# EAGLE design Arduino-Pro-Mini-v10 (EAGLE 6.4)
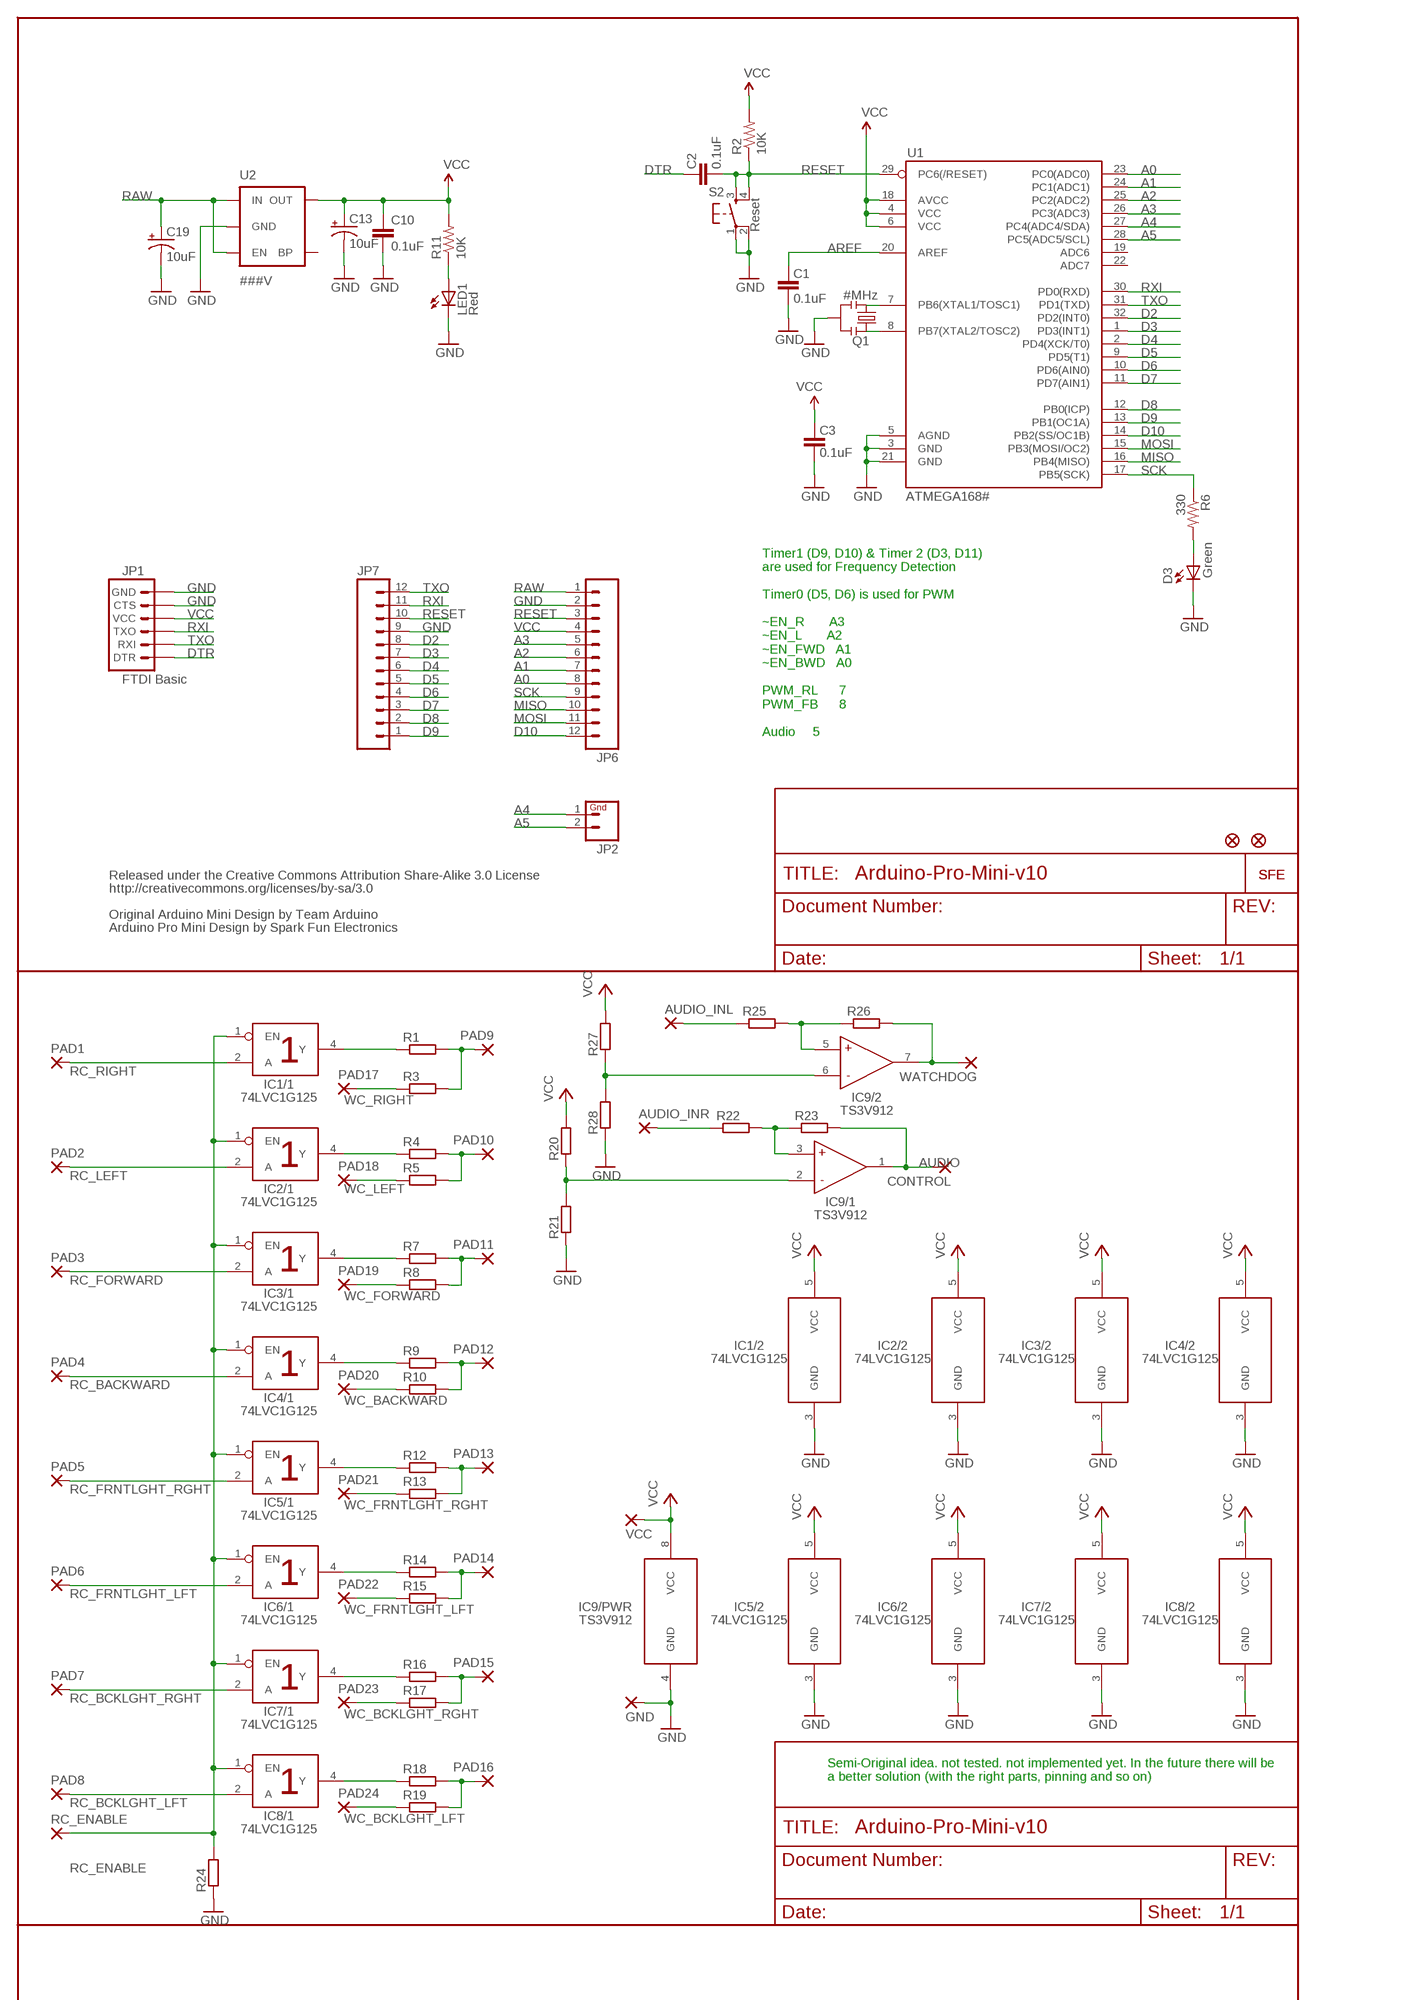
[diagram p0: schematic, sheet 1, part 1 of 2]
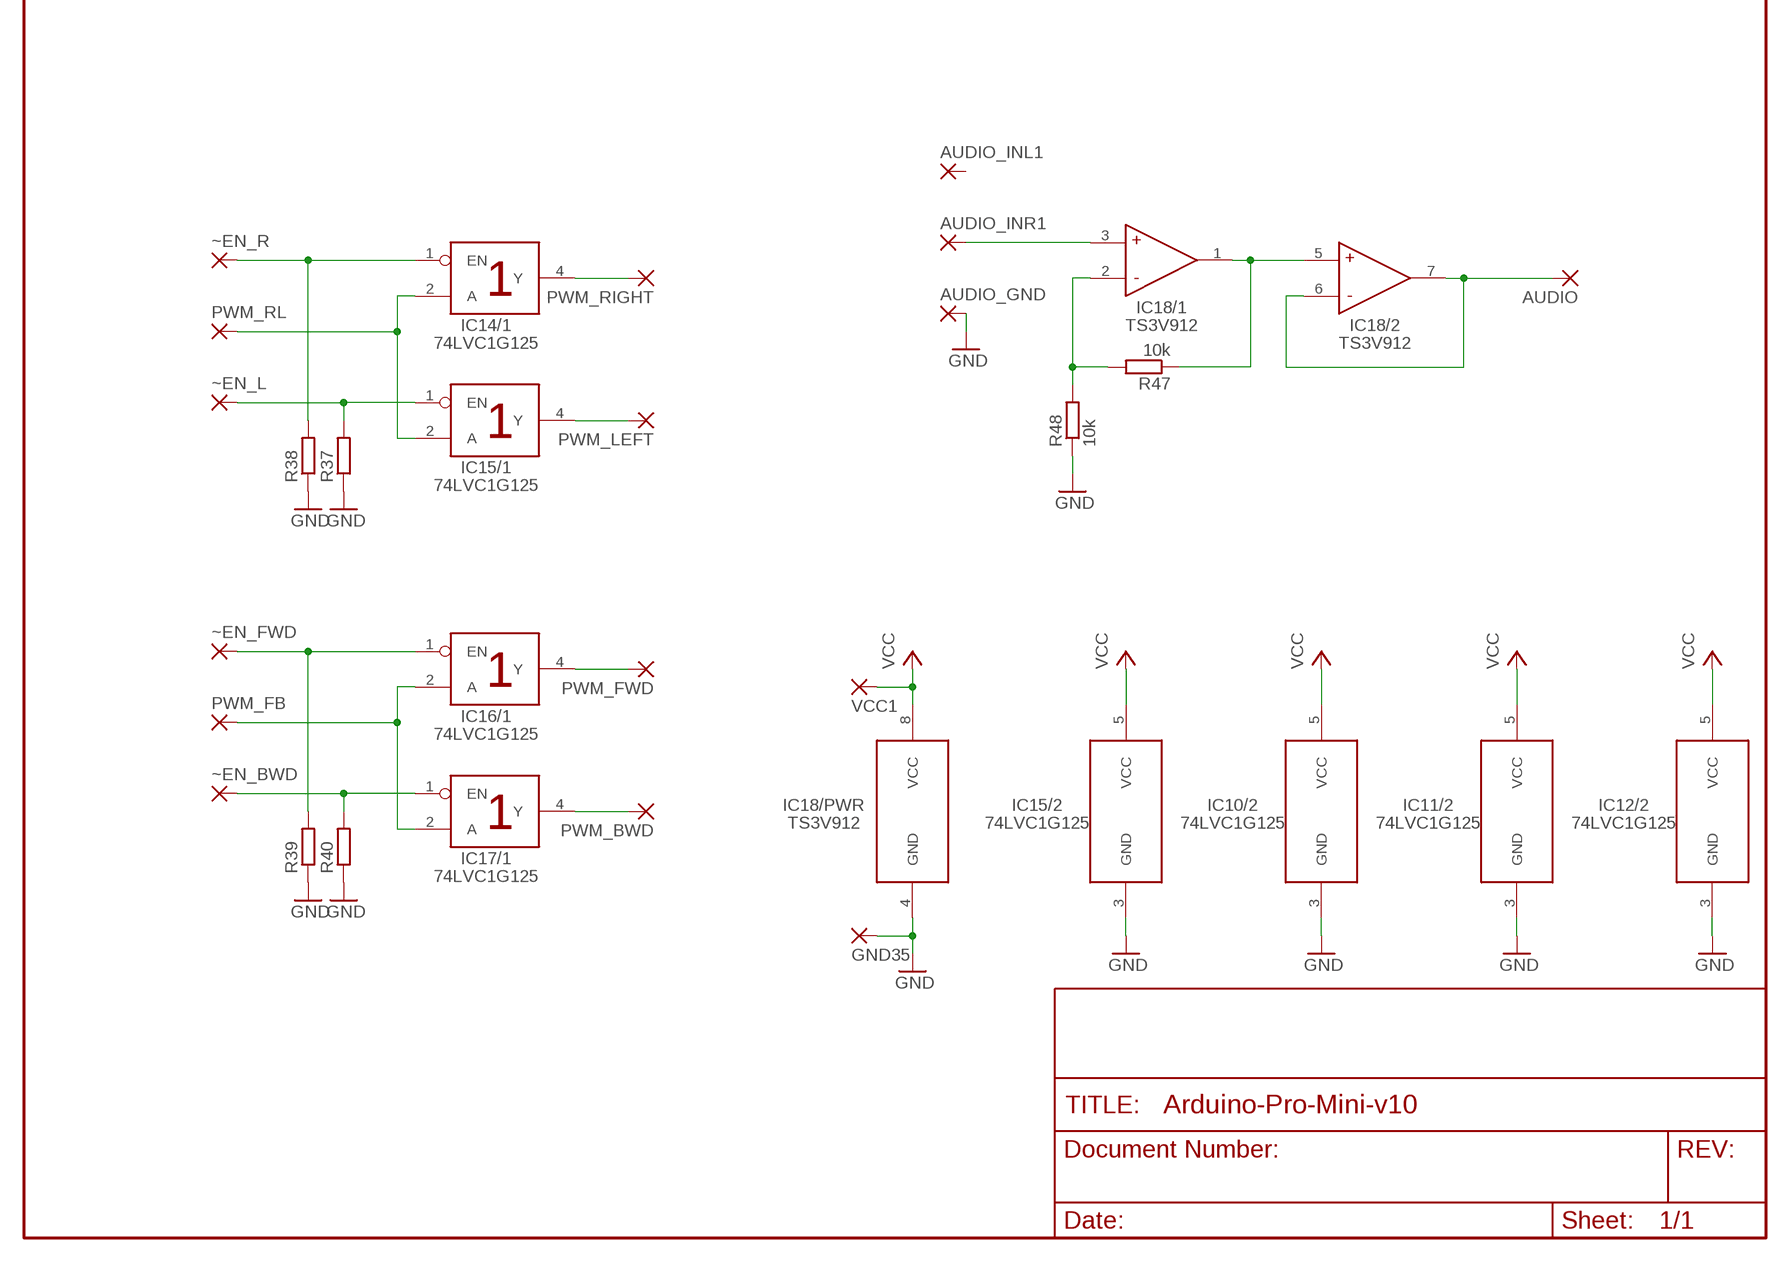
[diagram p1: schematic, sheet 1, part 2 of 2]

## Parts
AUDIO  SMD2  [SMD1,27-2,54]
AUDIO_GND  SMD2  [SMD1,27-2,54]
AUDIO_INL  SMD2  [SMD1,27-2,54]
AUDIO_INL1  SMD2  [SMD1,27-2,54]
AUDIO_INR  SMD2  [SMD1,27-2,54]
AUDIO_INR1  SMD2  [SMD1,27-2,54]
C1  0.1uF  CAP0402  [C0402]
C2  0.1uF  CAP0402  [C0402]
C3  0.1uF  CAP0402  [C0402]
C10  0.1uF  CAP0402  [C0402]
C13  10uF  CAP_POL1206  [EIA3216]
C19  10uF  CAP_POL1206  [EIA3216]
CONTROL  SMD2  [SMD1,27-2,54]
D3  Green  LED0603  [LED-0603]
GND  SMD2  [SMD1,27-2,54]
GND35  SMD2  [SMD1,27-2,54]
IC1  74LVC1G125  [DBV_R-PDSO-G5]
IC2  74LVC1G125  [DBV_R-PDSO-G5]
IC3  74LVC1G125  [DBV_R-PDSO-G5]
IC4  74LVC1G125  [DBV_R-PDSO-G5]
IC5  74LVC1G125  [DBV_R-PDSO-G5]
IC6  74LVC1G125  [DBV_R-PDSO-G5]
IC7  74LVC1G125  [DBV_R-PDSO-G5]
IC8  74LVC1G125  [DBV_R-PDSO-G5]
IC9  TS3V912  [SO8]
IC10  74LVC1G125  [DBV_R-PDSO-G5]
IC11  74LVC1G125  [DBV_R-PDSO-G5]
IC12  74LVC1G125  [DBV_R-PDSO-G5]
IC14  74LVC1G125  [DBV_R-PDSO-G5]
IC15  74LVC1G125  [DBV_R-PDSO-G5]
IC16  74LVC1G125  [DBV_R-PDSO-G5]
IC17  74LVC1G125  [DBV_R-PDSO-G5]
IC18  TS3V912  [SO8]
JP1  FTDI Basic  ARDUINO_SERIAL_PROGRAMPTH  [1X06]
JP2  M02PTH  [1X02]
JP6  M12PTH  [1X12]
JP7  M12PTH  [1X12]
LED1  Red  LED0603  [LED-0603]
PAD1  SMD2  [SMD1,27-2,54]
PAD2  SMD2  [SMD1,27-2,54]
PAD3  SMD2  [SMD1,27-2,54]
PAD4  SMD2  [SMD1,27-2,54]
PAD5  SMD2  [SMD1,27-2,54]
PAD6  SMD2  [SMD1,27-2,54]
PAD7  SMD2  [SMD1,27-2,54]
PAD8  SMD2  [SMD1,27-2,54]
PAD9  SMD2  [SMD1,27-2,54]
PAD10  SMD2  [SMD1,27-2,54]
PAD11  SMD2  [SMD1,27-2,54]
PAD12  SMD2  [SMD1,27-2,54]
PAD13  SMD2  [SMD1,27-2,54]
PAD14  SMD2  [SMD1,27-2,54]
PAD15  SMD2  [SMD1,27-2,54]
PAD16  SMD2  [SMD1,27-2,54]
PAD17  SMD2  [SMD1,27-2,54]
PAD18  SMD2  [SMD1,27-2,54]
PAD19  SMD2  [SMD1,27-2,54]
PAD20  SMD2  [SMD1,27-2,54]
PAD21  SMD2  [SMD1,27-2,54]
PAD22  SMD2  [SMD1,27-2,54]
PAD23  SMD2  [SMD1,27-2,54]
PAD24  SMD2  [SMD1,27-2,54]
PWM_BWD  SMD2  [SMD1,27-2,54]
PWM_FB  SMD2  [SMD1,27-2,54]
PWM_FWD  SMD2  [SMD1,27-2,54]
PWM_LEFT  SMD2  [SMD1,27-2,54]
PWM_RIGHT  SMD2  [SMD1,27-2,54]
PWM_RL  SMD2  [SMD1,27-2,54]
Q1  #MHz  RESONATORSMD  [RESONATOR-SMD]
R1  R-EU_M0805  [M0805]
R2  10K  RESISTOR0402  [C0402]
R3  R-EU_M0805  [M0805]
R4  R-EU_M0805  [M0805]
R5  R-EU_M0805  [M0805]
R6  330  RESISTOR0402  [C0402]
R7  R-EU_M0805  [M0805]
R8  R-EU_M0805  [M0805]
R9  R-EU_M0805  [M0805]
R10  R-EU_M0805  [M0805]
R11  10K  RESISTOR0402  [C0402]
R12  R-EU_M0805  [M0805]
R13  R-EU_M0805  [M0805]
R14  R-EU_M0805  [M0805]
R15  R-EU_M0805  [M0805]
R16  R-EU_M0805  [M0805]
R17  R-EU_M0805  [M0805]
R18  R-EU_M0805  [M0805]
R19  R-EU_M0805  [M0805]
R20  R-EU_M0805  [M0805]
R21  R-EU_M0805  [M0805]
R22  R-EU_M0805  [M0805]
R23  R-EU_M0805  [M0805]
R24  R-EU_M0805  [M0805]
R25  R-EU_M0805  [M0805]
R26  R-EU_M0805  [M0805]
R27  R-EU_M0805  [M0805]
R28  R-EU_M0805  [M0805]
R37  R-EU_M0805  [M0805]
R38  R-EU_M0805  [M0805]
R39  R-EU_M0805  [M0805]
R40  R-EU_M0805  [M0805]
R47  10k  R-EU_M0805  [M0805]
R48  10k  R-EU_M0805  [M0805]
RC_ENABLE  SMD2  [SMD1,27-2,54]
S2  Reset  TAC_SWITCHSND  [TACTILE_SWITCH_SMD]
U1  ATMEGA168#  ATMEGA168  [TQFP32-08]
U2  ###V  V_REG_LDOSMD  [SOT23-5]
U$1  LOGO-SFESK  [SFE-LOGO-FLAME]
U$2  FIDUCIAL1X2  [FIDUCIAL-1X2]
U$4  FIDUCIAL1X2  [FIDUCIAL-1X2]
U$11  LOGO-SFENEW  [SFE-NEW-WEBLOGO]
VCC  SMD2  [SMD1,27-2,54]
VCC1  SMD2  [SMD1,27-2,54]
WATCHDOG  SMD2  [SMD1,27-2,54]
~EN_BWD  SMD2  [SMD1,27-2,54]
~EN_FWD  SMD2  [SMD1,27-2,54]
~EN_L  SMD2  [SMD1,27-2,54]
~EN_R  SMD2  [SMD1,27-2,54]

## Nets
A0: JP6.8 U1.23(PC0(ADC0))
A1: JP6.7 U1.24(PC1(ADC1))
A2: JP6.6 U1.25(PC2(ADC2))
A3: JP6.5 U1.26(PC3(ADC3))
A4: JP2.1 U1.27(PC4(ADC4/SDA))
A5: JP2.2 U1.28(PC5(ADC5/SCL))
AREF: C1.2 U1.20(AREF)
AUDIO: AUDIO.1(P) CONTROL.1(P) IC9.1(/1:OUT) IC18.6(/2:-) IC18.7(/2:OUT) R23.2
D2: JP7.8 U1.32(PD2(INT0))
D3: JP7.7 U1.1(PD3(INT1))
D4: JP7.6 U1.2(PD4(XCK/T0))
D5: JP7.5 U1.9(PD5(T1))
D6: JP7.4 U1.10(PD6(AIN0))
D7: JP7.3 U1.11(PD7(AIN1))
D8: JP7.2 U1.12(PB0(ICP))
D9: JP7.1 U1.13(PB1(OC1A))
D10: JP6.12 U1.14(PB2(SS/OC1B))
DTR: C2.2 JP1.1(DTR)
GND [vcc]: AUDIO_GND.1(P) C1.1 C3.1 C10.2 C13.C(-) C19.C(-) D3.C GND35.1(P) GND.1(P) IC1.3(/2:GND) IC2.3(/2:GND) IC3.3(/2:GND) IC4.3(/2:GND) IC5.3(/2:GND) IC6.3(/2:GND) IC7.3(/2:GND) IC8.3(/2:GND) IC9.4(/PWR:GND) IC10.3(/2:GND) IC11.3(/2:GND) IC12.3(/2:GND) IC15.3(/2:GND) IC18.4(/PWR:GND) JP1.5(CTS) JP1.6(GND) JP6.2 JP7.9 LED1.C Q1.2 R21.1 R24.1 R28.1 R37.1 R38.1 R39.1 R40.1 R48.1 S2.1 S2.2 U1.3(GND) U1.5(AGND) U1.21(GND) U2.2(GND)
MISO: JP6.10 U1.16(PB4(MISO))
MOSI: JP6.11 U1.15(PB3(MOSI/OC2))
N$1: Q1.1 U1.8(PB7(XTAL2/TOSC2))
N$2: Q1.3 U1.7(PB6(XTAL1/TOSC1))
N$3: IC9.2(/1:-) R20.1 R21.2
N$4: PAD9.1(P) R1.2 R3.2
N$5: PAD10.1(P) R4.2 R5.2
N$6: IC1.4(/1:Y) R1.1
N$7: D3.A R6.2
N$8: IC2.4(/1:Y) R4.1
N$9: IC3.4(/1:Y) R7.1
N$10: IC4.4(/1:Y) R9.1
N$11: IC5.4(/1:Y) R12.1
N$12: IC6.4(/1:Y) R14.1
N$13: IC7.4(/1:Y) R16.1
N$14: IC8.4(/1:Y) R18.1
N$15: PAD11.1(P) R7.2 R8.2
N$16: PAD12.1(P) R9.2 R10.2
N$17: PAD13.1(P) R12.2 R13.2
N$18: PAD14.1(P) R14.2 R15.2
N$19: PAD15.1(P) R16.2 R17.2
N$20: PAD16.1(P) R18.2 R19.2
N$21: IC9.5(/2:+) R25.2 R26.1
N$22: IC9.7(/2:OUT) R26.2 WATCHDOG.1(P)
N$23: IC9.6(/2:-) R27.1 R28.2
N$24: AUDIO_INL.1(P) R25.1
N$25: IC14.2(/1:A) IC15.2(/1:A) PWM_RL.1(P)
N$26: IC16.2(/1:A) IC17.2(/1:A) PWM_FB.1(P)
N$27: IC15.1(/1:EN) R37.2 ~EN_L.1(P)
N$28: IC14.1(/1:EN) R38.2 ~EN_R.1(P)
N$29: IC17.1(/1:EN) R40.2 ~EN_BWD.1(P)
N$30: IC16.1(/1:EN) R39.2 ~EN_FWD.1(P)
N$31: IC16.4(/1:Y) PWM_FWD.1(P)
N$32: IC9.3(/1:+) R22.2 R23.1
N$33: AUDIO_INR.1(P) R22.1
N$34: IC17.4(/1:Y) PWM_BWD.1(P)
N$35: IC14.4(/1:Y) PWM_RIGHT.1(P)
N$36: IC15.4(/1:Y) PWM_LEFT.1(P)
N$38: LED1.A R11.1
N$44: IC18.1(/1:OUT) IC18.5(/2:+) R47.1
N$45: IC18.2(/1:-) R47.2 R48.2
N$47: AUDIO_INR1.1(P) IC18.3(/1:+)
RAW [vcc]: C19.A(+) JP6.1 U2.1(IN) U2.3(EN)
RC_BACKWARD: IC4.2(/1:A) PAD4.1(P)
RC_BCKLGHT_LFT: IC8.2(/1:A) PAD8.1(P)
RC_BCKLGHT_RGHT: IC7.2(/1:A) PAD7.1(P)
RC_ENABLE: IC1.1(/1:EN) IC2.1(/1:EN) IC3.1(/1:EN) IC4.1(/1:EN) IC5.1(/1:EN) IC6.1(/1:EN) IC7.1(/1:EN) IC8.1(/1:EN) R24.2 RC_ENABLE.1(P)
RC_FORWARD: IC3.2(/1:A) PAD3.1(P)
RC_FRNTLGHT_LFT: IC6.2(/1:A) PAD6.1(P)
RC_FRNTLGHT_RGHT: IC5.2(/1:A) PAD5.1(P)
RC_LEFT: IC2.2(/1:A) PAD2.1(P)
RC_RIGHT: IC1.2(/1:A) PAD1.1(P)
RESET: C2.1 JP6.3 JP7.10 R2.1 S2.3 S2.4 U1.29(PC6(/RESET))
RXI: JP1.3(TXO) JP7.11 U1.30(PD0(RXD))
SCK: JP6.9 R6.1 U1.17(PB5(SCK))
TXO: JP1.2(RXI) JP7.12 U1.31(PD1(TXD))
VCC: C3.2 C10.1 C13.A(+) IC1.5(/2:VCC) IC2.5(/2:VCC) IC3.5(/2:VCC) IC4.5(/2:VCC) IC5.5(/2:VCC) IC6.5(/2:VCC) IC7.5(/2:VCC) IC8.5(/2:VCC) IC9.8(/PWR:VCC) IC10.5(/2:VCC) IC11.5(/2:VCC) IC12.5(/2:VCC) IC15.5(/2:VCC) IC18.8(/PWR:VCC) JP1.4(VCC) JP6.4 R2.2 R11.2 R20.2 R27.2 U1.4(VCC) U1.6(VCC) U1.18(AVCC) U2.5(OUT) VCC1.1(P) VCC.1(P)
WC_BACKWARD: PAD20.1(P) R10.1
WC_BCKLGHT_LFT: PAD24.1(P) R19.1
WC_BCKLGHT_RGHT: PAD23.1(P) R17.1
WC_FORWARD: PAD19.1(P) R8.1
WC_FRNTLGHT_LFT: PAD22.1(P) R15.1
WC_FRNTLGHT_RGHT: PAD21.1(P) R13.1
WC_LEFT: PAD18.1(P) R5.1
WC_RIGHT: PAD17.1(P) R3.1
Unconnected: AUDIO_INL1.1(P) IC10.1(/1:EN) IC10.2(/1:A) IC10.4(/1:Y) IC11.1(/1:EN) IC11.2(/1:A) IC11.4(/1:Y) IC12.1(/1:EN) IC12.2(/1:A) IC12.4(/1:Y) IC14.3(/2:GND) IC14.5(/2:VCC) IC16.3(/2:GND) IC16.5(/2:VCC) IC17.3(/2:GND) IC17.5(/2:VCC) U1.19(ADC6) U1.22(ADC7) U2.4(BP)

## Notes on the sheet
- Timer1 (D9, D10) & Timer 2 (D3, D11)
  are used for Frequency Detection
  
  Timer0 (D5, D6) is used for PWM
  
  ~EN_R       A3
  ~EN_L       A2
  ~EN_FWD   A1
  ~EN_BWD   A0
  
  PWM_RL      7
  PWM_FB      8
  
  Audio     5
- Released under the Creative Commons Attribution Share-Alike 3.0 License
- http://creativecommons.org/licenses/by-sa/3.0
- Original Arduino Mini Design by Team Arduino
- Arduino Pro Mini Design by Spark Fun Electronics
- Semi-Original idea. not tested. not implemented yet. In the future there will be 
  a better solution (with the right parts, pinning and so on)

## Library data of the parts
AUDIO AUDIO_GND AUDIO_INL AUDIO_INL1 AUDIO_INR AUDIO_INR1 CONTROL GND GND35 PAD1-PAD24 PWM_BWD PWM_FB PWM_FWD PWM_LEFT PWM_RIGHT PWM_RL RC_ENABLE VCC VCC1 WATCHDOG ~EN_BWD ~EN_FWD ~EN_L ~EN_R = wirepad:SMD2: SMD PAD
C1-C3 C10 = SparkFun:CAP: Capacitor Standard 0603 ceramic capacitor, and 0.1" leaded capacitor.
C13 C19 = SparkFun:CAP_POL: Capacitor Polarized These are standard SMD and PTH capacitors. Normally 10uF, 47uF, and 100uF in electrolytic and tantalum varieties. Always verify the external diameter of the through hole cap, it varies with capacity, voltage, and manufacturer. The EIA devices should be standard.
D3 LED1 = SparkFun:LED: LEDs Standard schematic elements and footprints for 5mm, 3mm, 1206, and 0603 sized LEDs. 5mm - Spark Fun Electronics SKU : COM-00529 (and others)
IC1-IC8 IC10-IC12 IC14-IC17 = WC-Car:74LVC1G125: 74LVC1G125 3-state single buffer with EN-input
IC9 IC18 = WC-Car:TS3V912: TS3V912 dual rail to rail operational amplifier
JP1 = SparkFun:ARDUINO_SERIAL_PROGRAM
JP2 = SparkFun:M02: Header 2 Standard 2-pin 0.1" header. Use with straight break away headers (SKU : PRT-00116), right angle break away headers (PRT-00553), swiss pins (PRT-00743), machine pins (PRT-00117), and female headers (PRT-00115). Molex polarized connector foot print use with SKU : PRT-08233 with associated crimp pins and housings.
JP6 JP7 = SparkFun:M12: Header 12 Standard 12-pin 0.1" header. Use with straight break away headers (SKU : PRT-00116), right angle break away headers (PRT-00553), swiss pins (PRT-00743), machine pins (PRT-00117), and female headers (PRT-00115).
Q1 = SparkFun:RESONATOR: Resonator Small SMD resonator. This is the itty bitty 10/20MHz resonators with built in caps. CSTCE10M0G55 and CSTCE20M0V53. Footprint has been reviewed closely but hasn't been tested yet.
R1 R3-R5 R7-R10 R12-R28 R37-R40 R47 R48 = resistor:R-EU_: RESISTOR, European symbol
R2 R6 R11 = SparkFun:RESISTOR: Resistor Basic schematic elements and footprints for 0603, 1206, and PTH 1/10th watt (small) resistors.
S2 = SparkFun:TAC_SWITCH: Momentary Switch Button commonly used for reset or general input. Spark Fun Electronics SKU : COM-00097
U1 = SparkFun:ATMEGA168
U2 = SparkFun:V_REG_LDO: Voltage Regulator LDO Standard 150mA LDO voltage regulator in SOT-23 layout. Micrel part MIC5205. BP (by-pass) pin is used to lower output noise with 470pF cap.
U$1 U$11 = SparkFun:LOGO-SFE: Spark Fun Electronics PCB Logo This is the standard Spark Fun Electronics PCB logo.
U$2 U$4 = SparkFun:FIDUCIAL: Fiducial Alignment Points Various fiducial points for machine vision alignment.

## Net classes
0 default: width 0.203 mm
1 vcc: width 0.254 mm

## Board
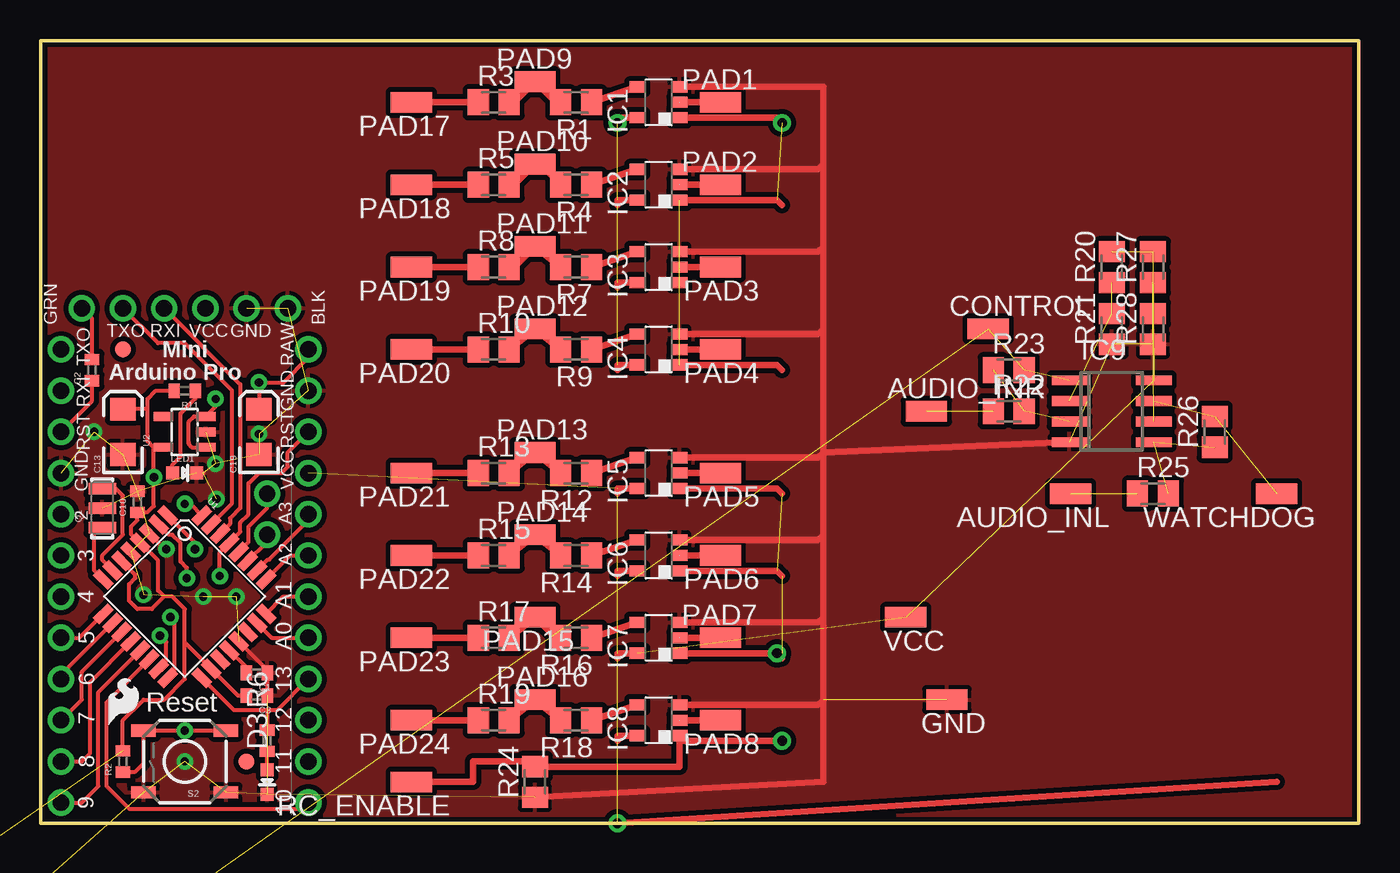
[diagram p2: board, top side]
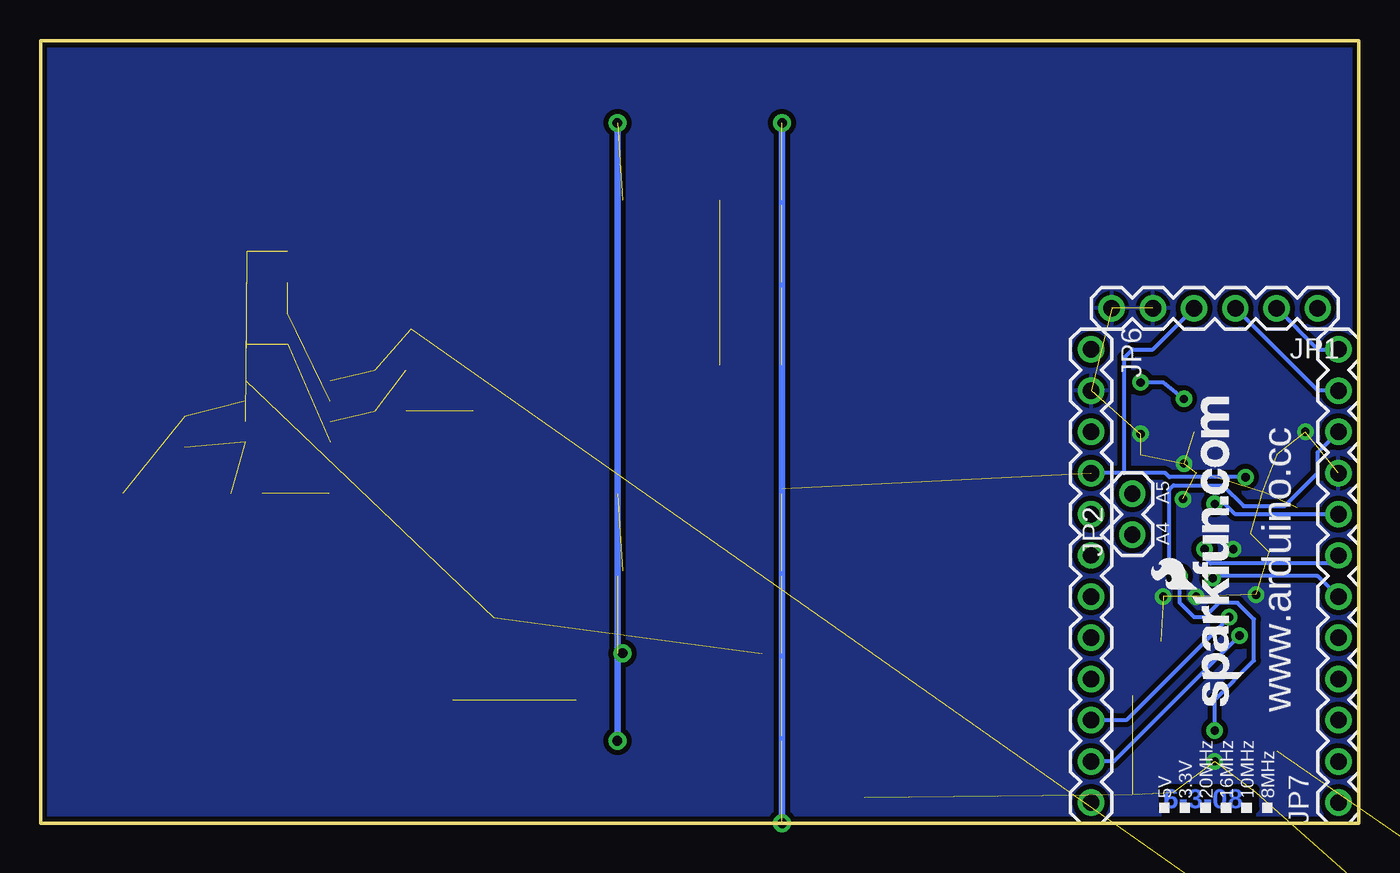
[diagram p3: board, bottom side, seen from below]

Size 81.28 x 48.26 mm. Coordinates in mm from the lower left corner, seen from the top.
Outline: 0,48.26 0,0 81.28,0 81.28,48.26 0,48.26
Copper layers (1*16): Top 0.035mm / dielectric 1.5mm / Bottom 0.035mm
Design rules "SparkFun *": minimum track width 8mil, minimum drill 20mil, track to track 8mil, track to pad 8mil, pad to pad 8mil, via to via 8mil, smd to smd 8mil, copper to edge 10mil, drill to drill 8mil, minimum pad ring 12mil, minimum via ring 10mil, stop-mask expansion 4mil, vias tented up to drill 20mil, thermal gap 10mil

### Footprints (pad centres in the part's own frame; a part is rotated, then mirrored left to right if it is on the bottom)
SMD1,27-2,54 = smd 1.27 x 2.54: 1 0,0
C0402 = smd 0.7 x 0.9: 1 -0.65,0; 2 0.65,0
EIA3216 = smd 1.4 x 1.6: A 1.4,0; C -1.4,0
LED-0603 = smd 0.8 x 0.8: A 0,-0.75; C 0,0.75
DBV_R-PDSO-G5 = smd 0.69 x 0.99: 1 -0.95,-1.29; 2 0,-1.29; 3 0.95,-1.29; 4 0.95,1.3; 5 -0.95,1.3
SO8 = smd 0.6 x 2.2: 1 -1.905,-2.6; 2 -0.635,-2.6; 3 0.635,-2.6; 4 1.905,-2.6; 5 1.905,2.6; 6 0.635,2.6; 7 -0.635,2.6; 8 -1.905,2.6
1X06 = drill 1.016: 1 0,0; 2 2.54,0; 3 5.08,0; 4 7.62,0; 5 10.16,0; 6 12.7,0
1X02 = drill 1.016: 1 0,0; 2 2.54,0
1X12 = drill 1.016: 1 0,0; 2 2.54,0; 3 5.08,0; 4 7.62,0; 5 10.16,0; 6 12.7,0; 7 15.24,0; 8 17.78,0; 9 20.32,0; 10 22.86,0; 11 25.4,0; 12 27.94,0
RESONATOR-SMD = smd 0.7 x 1.7: 1 -1.2,0; 2 0,0; 3 1.2,0
M0805 = smd 1.3 x 1.6: 1 -0.95,0; 2 0.95,0
TACTILE_SWITCH_SMD = smd 1.524 x 0.762: 1 -2.54,1.905; 2 2.54,1.905; 3 -2.54,-1.905; 4 2.54,-1.905
TQFP32-08 = smd 1.27 x 0.559: 1 -4.293,2.8; 2 -4.293,2; 3 -4.293,1.2; 4 -4.293,0.4; 5 -4.293,-0.4; 6 -4.293,-1.2; 7 -4.293,-2; 8 -4.293,-2.8; 17 4.293,-2.8; 18 4.293,-2; 19 4.293,-1.2; 20 4.293,-0.4; 21 4.293,0.4; 22 4.293,1.2; 23 4.293,2; 24 4.293,2.8 | smd 0.559 x 1.27: 9 -2.8,-4.293; 10 -2,-4.293; 11 -1.2,-4.293; 12 -0.4,-4.293; 13 0.4,-4.293; 14 1.2,-4.293; 15 2,-4.293; 16 2.8,-4.293; 25 2.8,4.293; 26 2,4.293; 27 1.2,4.293; 28 0.4,4.293; 29 -0.4,4.293; 30 -1.2,4.293; 31 -2,4.293; 32 -2.8,4.293
SOT23-5 = smd 0.55 x 1.2: 1 -0.95,-1.3; 2 0,-1.3; 3 0.95,-1.3; 4 0.95,1.3; 5 -0.95,1.3
FIDUCIAL-1X2 = smd 1 x 1: 1 0,0

### Placement (x,y rotation side)
AUDIO  -10.16,-17.78 0 top  (outside the outline)
AUDIO_GND  -45.72,-60.96 0 top  (outside the outline)
AUDIO_INL  63.5,20.32 90 top
AUDIO_INL1  -35.56,-17.78 0 top  (outside the outline)
AUDIO_INR  54.61,25.4 270 top
AUDIO_INR1  -30.48,-17.78 0 top  (outside the outline)
C1  13.34,9.27 180 top
C2  3.17,27.94 90 top
C3  13.34,7.87 180 top
C10  5.97,19.81 90 top
C13  5.08,24.13 90 top
C19  13.46,24.13 90 top
CONTROL  58.42,30.48 270 top
D3  13.97,2.54 180 top
GND  55.88,7.62 90 top
GND35  0,-35.56 0 top  (outside the outline)
IC1  38.1,44.45 90 top
IC2  38.1,39.37 90 top
IC3  38.1,34.29 90 top
IC4  38.1,29.21 90 top
IC5  38.1,21.59 90 top
IC6  38.1,16.51 90 top
IC7  38.1,11.43 90 top
IC8  38.1,6.35 90 top
IC9  66.04,25.4 270 top
IC10  -45.72,-71.12 0 top  (outside the outline)
IC11  -45.72,-78.74 0 top  (outside the outline)
IC12  -45.72,-86.36 0 top  (outside the outline)
IC14  -2.54,-27.94 0 top  (outside the outline)
IC15  -40.64,-35.56 0 top  (outside the outline)
IC16  -27.94,-35.56 0 top  (outside the outline)
IC17  -15.24,-35.56 0 top  (outside the outline)
IC18  -17.78,-15.24 0 top  (outside the outline)
JP1  2.54,31.75 180 bottom
JP2  13.97,17.78 90 bottom
JP6  16.51,29.21 270 bottom
JP7  1.27,1.27 90 bottom
LED1  8.89,21.59 270 top
PAD1  41.91,44.45 270 top
PAD2  41.91,39.37 270 top
PAD3  41.91,34.29 90 top
PAD4  41.91,29.21 90 top
PAD5  41.91,21.59 90 top
PAD6  41.91,16.51 90 top
PAD7  41.91,11.43 270 top
PAD8  41.91,6.35 90 top
PAD9  30.48,45.72 270 top
PAD10  30.48,40.64 270 top
PAD11  30.48,35.56 270 top
PAD12  30.48,30.48 270 top
PAD13  30.48,22.86 270 top
PAD14  30.48,17.78 270 top
PAD15  30.48,12.7 90 top
PAD16  30.48,7.62 270 top
PAD17  22.86,44.45 90 top
PAD18  22.86,39.37 90 top
PAD19  22.86,34.29 90 top
PAD20  22.86,29.21 90 top
PAD21  22.86,21.59 90 top
PAD22  22.86,16.51 90 top
PAD23  22.86,11.43 90 top
PAD24  22.86,6.35 90 top
PWM_BWD  15.24,-43.18 0 top  (outside the outline)
PWM_FB  -5.08,-50.8 0 top  (outside the outline)
PWM_FWD  0,-50.8 0 top  (outside the outline)
PWM_LEFT  -10.16,-50.8 0 top  (outside the outline)
PWM_RIGHT  -15.24,-50.8 0 top  (outside the outline)
PWM_RL  -25.4,-43.18 0 top  (outside the outline)
Q1  3.81,19.43 90 top
R1  33.02,44.45 180 top
R2  5.08,3.81 90 top
R3  27.94,44.45 0 top
R4  33.02,39.37 180 top
R5  27.94,39.37 0 top
R6  13.97,5.08 270 top
R7  33.02,34.29 180 top
R8  27.94,34.29 0 top
R9  33.02,29.21 180 top
R10  27.94,29.21 0 top
R11  8.89,26.67 180 top
R12  33.02,21.59 180 top
R13  27.94,21.59 0 top
R14  33.02,16.51 180 top
R15  27.94,16.51 0 top
R16  33.02,11.43 180 top
R17  27.94,11.43 0 top
R18  33.02,6.35 180 top
R19  27.94,6.35 0 top
R20  66.04,34.29 90 top
R21  66.04,30.48 90 top
R22  59.69,25.4 0 top
R23  59.69,27.94 0 top
R24  30.48,2.54 90 top
R25  68.58,20.32 0 top
R26  72.39,24.13 90 top
R27  68.58,34.29 90 top
R28  68.58,30.48 90 top
R37  -5.08,-58.42 0 top  (outside the outline)
R38  0,-58.42 0 top  (outside the outline)
R39  5.08,-58.42 0 top  (outside the outline)
R40  10.16,-58.42 0 top  (outside the outline)
R47  -10.16,-63.5 0 top  (outside the outline)
R48  -5.08,-63.5 0 top  (outside the outline)
RC_ENABLE  22.86,2.54 90 top
S2  8.89,3.81 180 top
U1  8.89,13.97 315 top
U2  8.89,24.13 90 top
U$1  4.19,6.1 0 top
U$2  12.7,3.81 0 top
U$4  5.08,29.21 0 top
U$11  7.11,7.24 90 bottom
VCC  53.34,12.7 90 top
VCC1  5.08,-50.8 0 top  (outside the outline)
WATCHDOG  76.2,20.32 90 top
~EN_BWD  -40.64,-20.32 0 top  (outside the outline)
~EN_FWD  -20.32,-43.18 0 top  (outside the outline)
~EN_L  -30.48,-43.18 0 top  (outside the outline)
~EN_R  -35.56,-43.18 0 top  (outside the outline)

### Tracks (layer width: path | path; a pad name or v marks a point on that pad's centre or on a via)
A0
  Top 0.254: U1.23 14.26,11.43 JP6.8
A1
  Top 0.254: U1.24 14.96,13.97 JP6.7
A2
  Top 0.254: U1.25 15.39,16.51 JP6.6
A3
  Top 0.254: 16.51,18.8 16.51,18.76 | U1.26 14,16.26 14.1,16.26 16.51,18.67 16.51,18.8 | 16.51,18.8 JP6.5
A4
  Top 0.254: U1.27 13.97,17.35 JP2.1
A5
  Top 0.254: U1.28 12.83,17.34 12.83,18.29 13.97,19.43 JP2.2
AREF
  Top 0.254: C1.2 12.7,9.59 U1.20
AUDIO  (5 unrouted)
D2  (via drill 0.51)
  Top 0.254: U1.32 9.25,19.68 v8.89,19.68
  Bottom 0.254: JP7.8 7.62,19.05 8.26,19.68 v8.89,19.68
D3  (via drill 0.51)
  Top 0.254: U1.1 9.53,17.3 v9.53,16.89
  Bottom 0.254: v9.53,16.89 9.53,16.38 9.14,16 1.78,16 JP7.7
D4  (via drill 0.51)
  Top 0.254: v9.02,15.11 9.02,15.75 8.64,16.13 8.64,17.27 8.13,17.78 7.91,17.78 U1.2
  Bottom 0.254: JP7.6 2.54,15.24 8.89,15.24 v9.02,15.11
D5
  Top 0.254: U1.9 2.39,11.43 JP7.5
D6
  Top 0.254: U1.10 1.27,9.18 JP7.4
D7
  Top 0.254: U1.11 2.54,9.32 2.54,7.62 JP7.3
D8
  Top 0.254: U1.12 3.05,8.69 3.05,4.32 2.54,3.81 JP7.2
D9
  Top 0.254: JP7.1 2.54,1.27 3.56,2.29 3.56,8.07 U1.13
D10
  Top 0.254: JP6.12 16.13,0.89 5.46,0.89 4.06,2.29 4.06,7.45 U1.14
DTR
  Top 0.254: C2.2 3.17,31.11 JP1.1
GND  (via drill 0.51)  (39 unrouted)
  Top 0.254: C3.1 13.97,7.87 13.97,9.26 C1.1 13.97,9.27 13.97,9.46 U1.21 | LED1.C 10.03,21.59 | U1.3 7.62,16.94 v7.75,16.89
  Top 0.406: IC1.3 48.26,45.4 48.26,40.64 | 48.26,40.64 48.26,35.56 | 48.26,35.56 48.26,30.48 | 48.26,30.48 48.26,22.86 | 48.26,22.86 48.26,17.78 | 48.26,17.78 48.26,12.7 | 48.26,12.7 48.26,7.62 | IC2.3 47.94,40.32 48.26,40.64 | IC3.3 47.94,35.24 48.26,35.56 | IC4.3 47.94,30.16 48.26,30.48 | IC5.3 47.94,22.54 48.26,22.86 | IC6.3 47.94,17.46 48.26,17.78 | IC7.3 47.94,12.38 48.26,12.7 | IC8.3 47.94,7.3 48.26,7.62 | IC9.4 48.26,22.86 | R24.1 48.26,2.54 48.26,7.62
  other vias: 12.06,13.97 10.03,13.97 8.89,3.81 3.3,24.13 10.85,19.99 10.79,22.17 6.35,14.1 13.46,24
  pour Top (isolate 0.305): 0,48.26 81.28,48.26 81.28,0 0,0
  pour Bottom (isolate 0.305): 0,48.26 81.28,48.26 81.28,0 0,0
MISO  (via drill 0.51)
  Top 0.254: U1.16 8.26,9.38 8.26,12.45 v8,12.7
  Bottom 0.254: v8,12.7 14.35,6.35 JP6.10
MOSI  (via drill 0.51)
  Top 0.254: U1.15 7.75,10 7.75,11.18 v7.37,11.56
  Bottom 0.254: JP6.11 15.11,3.81 v7.37,11.56
N$1
  Top 0.254: Q1.1 3.61,18.16 3.3,18.16 3.3,15.6 U1.8
N$2
  Top 0.254: U1.7 3.81,16.22 3.81,16.51 5.08,17.78 5.08,20.19 4.64,20.63 Q1.3
N$3  (2 unrouted)
N$4
  Top 0.406: R3.2 29.21,44.45 PAD9.1 31.75,44.45 R1.2
N$5
  Top 0.406: R5.2 29.21,39.37 PAD10.1 30.8,40.64 R4.2
N$6
  Top 0.406: R1.1 IC1.4
N$7
  Top 0.254: D3.A R6.2
N$8
  Top 0.406: R4.1 IC2.4
N$9
  Top 0.406: R7.1 IC3.4
N$10
  Top 0.406: R9.1 IC4.4
N$11
  Top 0.406: R12.1 IC5.4
N$12
  Top 0.406: IC6.4 R14.1
N$13
  Top 0.406: R16.1 IC7.4
N$14
  Top 0.406: R18.1 IC8.4
N$15
  Top 0.406: R8.2 29.21,34.29 PAD11.1 R7.2
N$16
  Top 0.406: R9.2 PAD12.1 R10.2
N$17
  Top 0.406: R13.2 PAD13.1 R12.2
N$18
  Top 0.406: R14.2 PAD14.1 R15.2
N$19
  Top 0.406: R17.2 PAD15.1 31.75,11.43 R16.2
N$20
  Top 0.406: R19.2 PAD16.1 R18.2
N$21  (2 unrouted)
N$22  (2 unrouted)
N$23  (2 unrouted)
N$24  (1 unrouted)
N$25  (2 unrouted)
N$26  (2 unrouted)
N$27  (2 unrouted)
N$28  (2 unrouted)
N$29  (2 unrouted)
N$30  (2 unrouted)
N$31  (1 unrouted)
N$32  (2 unrouted)
N$33  (1 unrouted)
N$34  (1 unrouted)
N$35  (1 unrouted)
N$36  (1 unrouted)
N$38
  Top 0.254: R11.1 9.54,26.18 8.64,25.27 8.64,22.61 8.13,22.1 8.13,21.59 LED1.A
N$44  (2 unrouted)
N$45  (2 unrouted)
N$47  (1 unrouted)
RAW  (via drill 0.51)
  Top 0.254: JP6.1 16.51,28.7 14.98,27.18 14.99,27.18 v13.46,27.18 C19.A | v10.79,26.16 10.79,25.68 U2.3 9.46,25.08 9.14,24.77 9.14,23.5 9.14,23.37 9.33,23.18 U2.1
  Bottom 0.254: v10.79,26.16 12.06,27.18 v13.46,27.18
RC_BACKWARD
  Top 0.406: PAD4.1 IC4.2
RC_BCKLGHT_LFT
  Top 0.406: PAD8.1 IC8.2
RC_BCKLGHT_RGHT
  Top 0.406: PAD7.1 IC7.2
RC_ENABLE  (via drill 0.6)  (6 unrouted)
  Top 0.406: IC1.1 45.4,43.5 v45.72,43.18 | IC2.1 45.4,38.42 45.72,38.1 | IC4.1 45.4,28.26 45.72,27.94 | IC5.1 45.4,20.64 45.72,20.32 | IC6.1 45.4,15.56 45.72,15.24 | IC7.1 v45.4,10.48 45.72,10.16 | RC_ENABLE.1 26.67,2.54 26.67,3.81 30.48,3.81 R24.2 39.39,3.49 IC8.1 39.39,5.08 v45.72,5.08
  Bottom 0.406: v45.72,43.18 45.72,10.16 | v45.4,10.48 45.72,10.48 v45.72,5.08
RC_FORWARD
  Top 0.406: PAD3.1 IC3.2
RC_FRNTLGHT_LFT
  Top 0.406: PAD6.1 IC6.2
RC_FRNTLGHT_RGHT
  Top 0.406: PAD5.1 IC5.2
RC_LEFT
  Top 0.406: IC2.2 PAD2.1
RC_RIGHT
  Top 0.406: IC1.2 PAD1.1
RESET  (via drill 0.51)
  Top 0.254: R2.1 5.09,3.17 5.84,3.17 6.35,3.68 S2.4 v8.89,5.71 S2.3 | JP6.3 15.24,22.86 15.24,21.97 14.86,21.59 13.46,21.59 12.83,20.95 12.83,19.05 12.32,18.54 12.32,17.96 U1.29 11.05,16.7 v11.05,15.24 | C2.1 3.17,26.04 JP7.10
  Bottom 0.254: v8.89,5.71 8.89,7.62 6.48,10.03 6.48,12.57 7.49,13.59 8.64,13.59 9.53,12.7 10.16,12.7 11.05,13.59 v11.05,15.24 11.68,15.88 11.68,20.57 11.43,20.83 8.38,20.83 7.11,19.56 4.57,19.56 2.54,21.59 2.54,22.86 JP7.10
RXI
  Top 0.254: U1.30 11.68,18.46 11.68,18.8 12.32,19.43 12.32,27.05 JP1.3
  Bottom 0.254: JP7.11 2.54,26.67 JP1.3
SCK
  Top 0.254: 13.97,6.99 11.94,6.99 11.91,6.99 U1.17 | 13.97,6.99 14.61,6.99 JP6.9 | 13.97,6.99 R6.1
TXO
  Top 0.254: U1.31 11.81,19.72 11.81,26.67 8.89,29.59 7.24,29.59 JP1.2
  Bottom 0.254: JP7.12 2.54,29.21 JP1.2
VCC  (via drill 0.51, 0.6)  (18 unrouted)
  Top 0.254: C13.A 6.6,25.53 | R11.2 7.11,26.67 6.6,26.16 6.6,25.53 | 8.94,11.1 U1.18 12.16,7.87 C3.2 | 8.94,11.1 8.89,11.14 | R2.2 5.08,6.35 6.35,7.62 7.62,7.62 8.89,8.89 8.89,11.05 | 8.89,11.05 8.94,11.1 | 7.62,13.97 7.24,14.35 7.24,16.19 U1.4 6.11,17.29 | 7.62,13.97 8.13,13.97 8.89,13.21 8.89,11.05 | 6.11,17.29 6.1,17.27 | 6.99,23.18 U2.5 | 6.11,17.29 5.59,17.81 5.59,18.29 5.97,18.67 C10.1 5.95,19.16 5.97,19.18 6.6,19.18 6.99,19.56 v6.99,21.34 6.99,23.18 | 6.99,23.18 6.6,23.56 6.6,25.53 | U1.6 5.84,15.32 5.84,15.11 5.46,14.73 5.46,13.72 5.97,13.21 6.86,13.21 7.62,13.97
  Top 0.305: C10.1 5.84,19.18
  Top 0.406: IC1.5 35.88,43.5 v35.56,43.18 | IC2.5 35.56,38.42 35.56,38.1 | IC3.5 35.56,33.34 35.56,33.02 | IC4.5 35.56,28.26 35.56,27.94 | IC5.5 35.56,20.64 35.56,20.32 | IC6.5 35.56,15.56 35.56,15.24 | IC7.5 35.56,10.48 35.56,10.16 | IC8.5 35.56,5.4 35.56,5.08 | v35.56,0 76.2,2.54
  Bottom 0.254: 14.48,21.59 JP6.4 | 14.48,21.59 14.48,28.7 13.97,29.21 12.7,29.21 JP1.4 | 14.48,21.59 11.94,21.59 11.68,21.34 v6.99,21.34
  Bottom 0.406: v35.56,43.18 v35.56,0
WC_BACKWARD
  Top 0.406: R10.1 PAD20.1
WC_BCKLGHT_LFT
  Top 0.406: PAD24.1 R19.1
WC_BCKLGHT_RGHT
  Top 0.406: PAD23.1 R17.1
WC_FORWARD
  Top 0.406: PAD19.1 R8.1
WC_FRNTLGHT_LFT
  Top 0.406: R15.1 PAD22.1
WC_FRNTLGHT_RGHT
  Top 0.406: PAD21.1 R13.1
WC_LEFT
  Top 0.406: PAD18.1 R5.1
WC_RIGHT
  Top 0.406: PAD17.1 R3.1

### Text on the board
Bottom: 6-3-08
tPlace: GRN | BLK | TXO | RXI | VCC | GND | Mini | TXO | RAW | Arduino Pro | RXI | GND | RST | RST | VCC | GND | 2 | A3 | 3 | A2 | 4 | A1 | 5 | A0 | 6 | 13 | Reset | 7 | 12 | 8 | 11 | 9 | 10 | Released under the Creative Commons Attribution Share-Alike 3.0 License | http://creativecommons.org/licenses/by-sa/3.0
bPlace: A5 | A4 | www.arduino.cc | 8MHz | 10MHz | 16MHz | 20MHz | 3.3V | 5V
tValues: Tent Vias! | Arduino Wee v1.3